# Altium schematic sheet DC_DC_ISO.SchDoc
size Legal
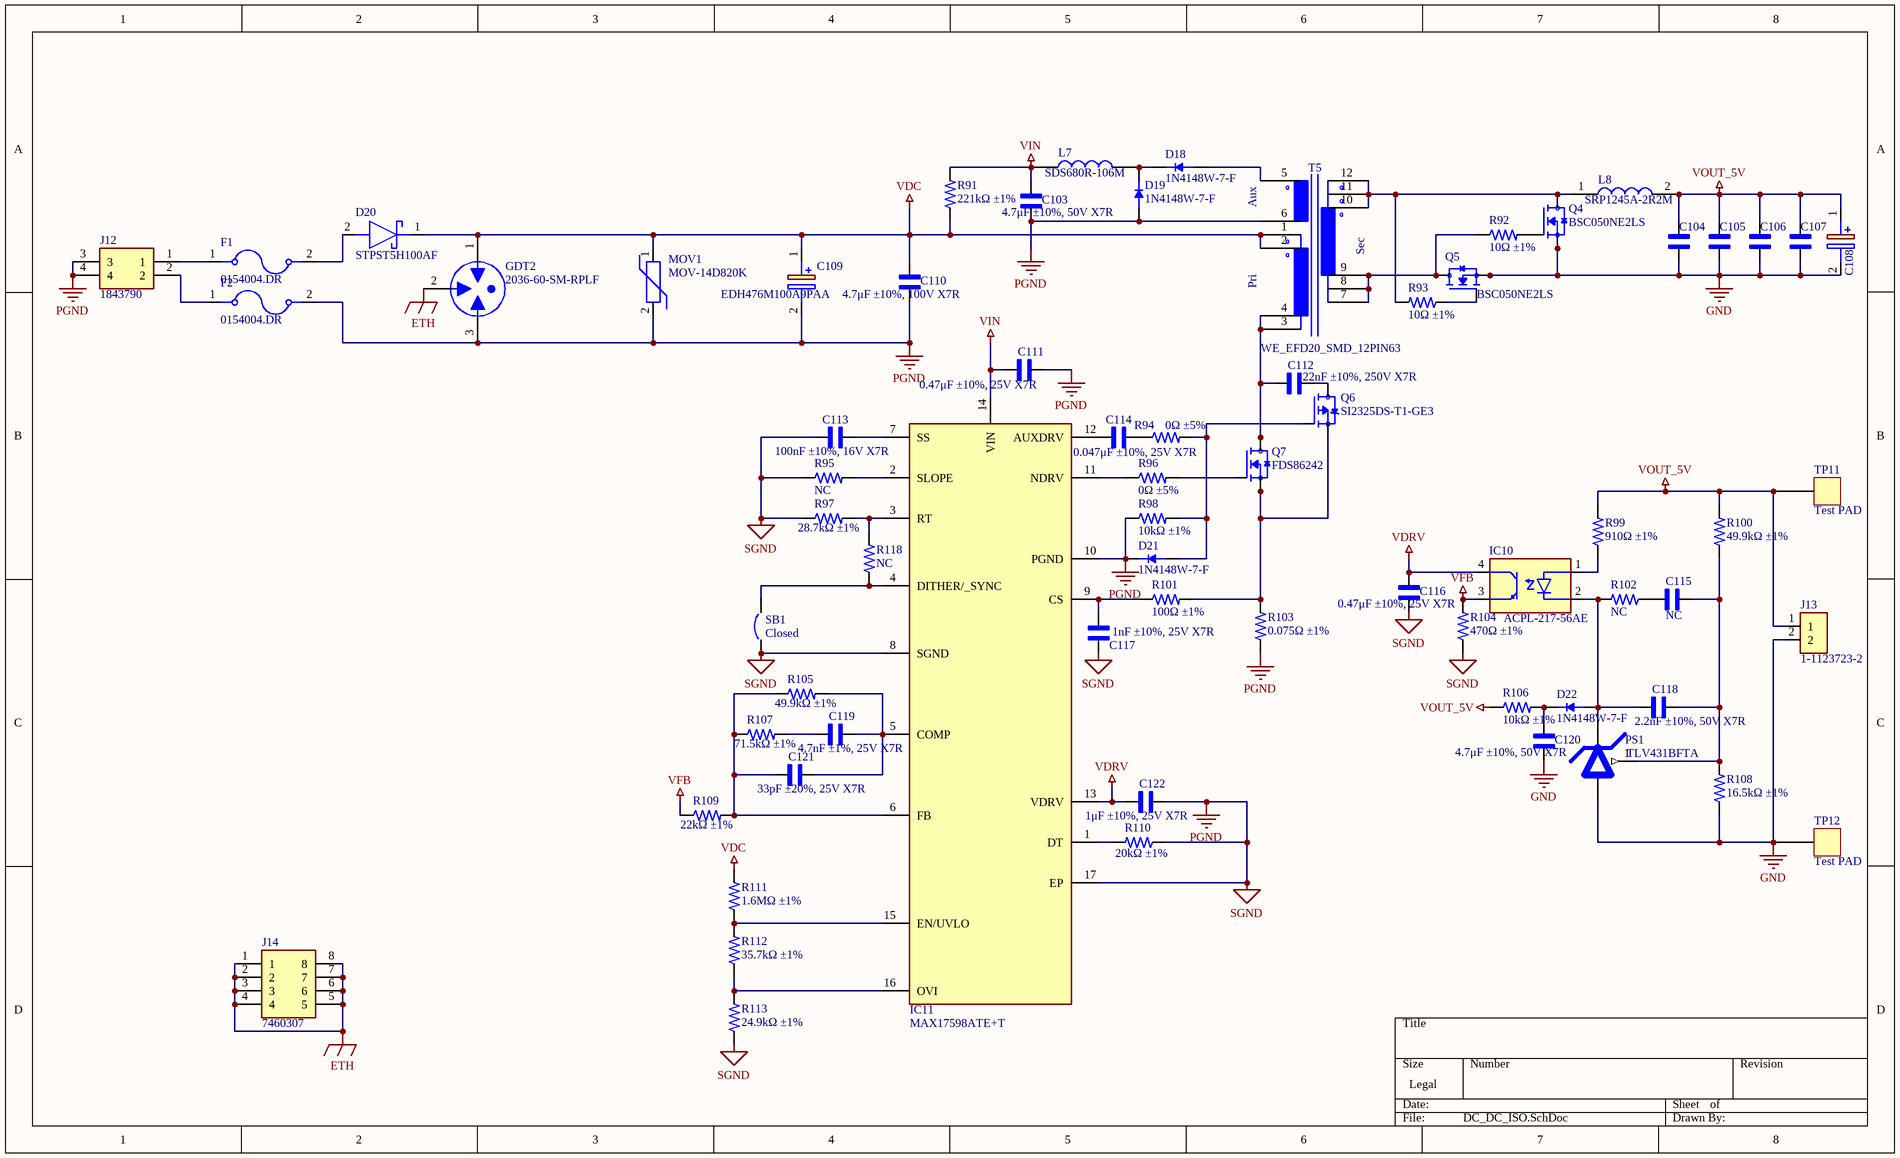
[diagram p0: DC_DC_ISO.SchDoc]

## Parts
C103  4.7μF ±10%, 50V X7R  [1206_C]
C104  47μF ±10%, 10V X7R  [1210_C]  (value not drawn)
C105  47μF ±10%, 10V X7R  [1210_C]  (value not drawn)
C106  47μF ±10%, 10V X7R  [1210_C]  (value not drawn)
C107  47μF ±10%, 10V X7R  [1210_C]  (value not drawn)
C108  TCJ5477M016R0100E/NI  [CAPPM7344X400N]  (value not drawn)
C109  EDH476M100A9PAA  [CAPAE1030X1050N]
C110  4.7μF ±10%, 100V X7R  [1210_C]
C111  0.47μF ±10%, 25V X7R  [0603_C]
C112  22nF ±10%, 250V X7R  [0805_C]
C113  100nF ±10%, 16V X7R  [0603_C]
C114  0.047μF ±10%, 25V X7R  [0603_C]
C115  NC  [0603_C]
C116  0.47μF ±10%, 25V X7R  [0603_C]
C117  1nF ±10%, 25V X7R  [0603_C]
C118  2.2nF ±10%, 50V X7R  [0603_C]
C119  4.7nF ±1%, 25V X7R  [0603_C]
C120  4.7μF ±10%, 50V X7R  [1206_C]
C121  33pF ±20%, 25V X7R  [0603_C]
C122  1μF ±10%, 25V X7R  [0805_C]
D18  1N4148W-7-F  [SOD3715X135N]
D19  1N4148W-7-F  [SOD3715X135N]
D20  STPST5H100AF  [SODFL4724X103N]
D21  1N4148W-7-F  [SOD3715X135N]
D22  1N4148W-7-F  [SOD3715X135N]
F1  0154004.DR  [FUSE_0154004.DR]
F2  0154004.DR  [FUSE_0154004.DR]
GDT2  2036-60-SM-RPLF  [2036-60-SM-RPLF]
IC10  ACPL-217-56AE  [SOIC127P700X242-4N]
IC11  MAX17598ATE+T  [QFN50P300X300X80-17N]
J12  1843790  [1843790]
J13  1-1123723-2  [TE_1-1123723-2]
J14  7460307  [7460307]
L7  SDS680R-106M  [SRR6603332ML]
L8  SRP1245A-2R2M  [INDPM135125X500N]
MOV1  MOV-14D820K  [MOV-14D820K]
PS1  TLV431BFTA  [SOT96P240X100-3N]
Q4  BSC050NE2LS  [BSC050NE2LS]
Q5  BSC050NE2LS  [BSC050NE2LS]
Q6  SI2325DS-T1-GE3  [SOT-23]
Q7  FDS86242  [SOIC127P600X175-8N]
R91  221kΩ ±1%  [0805_R]
R92  10Ω ±1%  [0603_R]
R93  10Ω ±1%  [0603_R]
R94  0Ω ±5%  [0603_R]
R95  NC  [0603_R]
R96  0Ω ±5%  [0603_R]
R97  28.7kΩ ±1%  [0603_R]
R98  10kΩ ±1%  [0603_R]
R99  910Ω ±1%  [0603_R]
R100  49.9kΩ ±1%  [0603_R]
R101  100Ω ±1%  [0603_R]
R102  NC  [0603_R]
R103  0.075Ω ±1%  [1206_R]
R104  470Ω ±1%  [0603_R]
R105  49.9kΩ ±1%  [0603_R]
R106  10kΩ ±1%  [0603_R]
R107  71.5kΩ ±1%  [0603_R]
R108  16.5kΩ ±1%  [0603_R]
R109  22kΩ ±1%  [0603_R]
R110  20kΩ ±1%  [0603_R]
R111  1.6MΩ ±1%  [0805_R]
R112  35.7kΩ ±1%  [0603_R]
R113  24.9kΩ ±1%  [0603_R]
R118  NC  [0603_R]
SB1  Closed  [SB_0603]
T5  WE_EFD20_SMD_12PIN63  [WE_EFD20_SMD_12PIN63]
TP11  Test PAD  [Test PAD]
TP12  Test PAD  [Test PAD]

## Nets
ETH: GDT2.2(E) J14.1 J14.2 J14.3 J14.4 J14.5 J14.6 J14.7 J14.8
GND: C104.2 C105.2 C106.2 C107.2 C108.2(-) C120.2 J13.2 PS1.3(ANODE) Q4.1(S) Q4.2(S) Q4.3(S) Q5.1(S) Q5.2(S) Q5.3(S) R108.1 TP12.1
PGND: C103.2 C109.2(-) C110.2 C111.2 C113.1 C116.2 C117.2 C122.2 D19.A D21.C(K) F2.2 GDT2.3(B) IC11.8(SGND) IC11.10(PGND) IC11.17(EP) J12.3 J12.4 MOV1.2 R95.1 R97.1 R98.1 R103.1 R104.1 R110.1 R113.1 SB1.1 T5.6  [also labelled SGND]
VDC: C109.1(+) C110.1 D20.1(K) GDT2.1(A) MOV1.1 R91.1 R111.2 T5.1 T5.2
VDRV: C116.1 C122.1 IC10.4(COLLECTOR) IC11.13(VDRV)
VFB: IC10.3(EMITTER) R104.2 R109.1
VIN: C103.1 C111.1 IC11.14(VIN) L7.1 R91.2
VOUT_5V: C104.1 C105.1 C106.1 C107.1 C108.1(+) J13.1 L8.2 R99.2 R100.2 R106.1 TP11.1
NetC112_1: C112.1 Q6.3(D)
NetC112_2: C112.2 Q7.5(D) Q7.6(D) Q7.7(D) Q7.8(D) T5.3 T5.4
NetC113_2: C113.2 IC11.7(SS)
NetC114_1: C114.1 R94.1
NetC114_2: C114.2 IC11.12(AUXDRV)
NetC115_1: C115.1 C118.1 PS1.1(REF) R100.1 R108.2
NetC115_2: C115.2 R102.1
NetC117_1: C117.1 IC11.9(CS) R101.1
NetC118_2: C118.2 D22.A IC10.2(CATHODE) PS1.2(CATHODE) R102.2
NetC119_1: C119.1 R107.2
NetC119_2: C119.2 C121.2 IC11.5(COMP) R105.2
NetC120_1: C120.1 D22.C(K) R106.2
NetC121_1: C121.1 IC11.6(FB) R105.1 R107.1 R109.2
NetD18_A: D18.A T5.5
NetD18_C: D18.C(K) D19.C(K) L7.2
NetD20_2: D20.2(A) F1.2
NetD21_A: D21.A Q6.1(G) R94.2 R98.2
NetF1_1: F1.1 J12.1
NetF2_1: F2.1 J12.2
NetIC10_1: IC10.1(ANODE) R99.1
NetIC11_1: IC11.1(DT) R110.2
NetIC11_2: IC11.2(SLOPE) R95.2
NetIC11_3: IC11.3(RT) R97.2 R118.2
NetIC11_4: IC11.4(DITHER/_SYNC) R118.1 SB1.2
NetIC11_11: IC11.11(NDRV) R96.1
NetIC11_15: IC11.15(EN/UVLO) R111.1 R112.2
NetIC11_16: IC11.16(OVI) R112.1 R113.2
NetL8_1: L8.1 Q4.5(D) Q4.6(D) Q4.7(D) Q4.8(D) Q4.9(D) R93.2 T5.10 T5.11 T5.12
NetQ4_4: Q4.4(G) R92.2
NetQ5_4: Q5.4(G) R93.1
NetQ5_5: Q5.5(D) Q5.6(D) Q5.7(D) Q5.8(D) Q5.9(D) R92.1 T5.7 T5.8 T5.9
NetQ6_2: Q6.2(S) Q7.1(S) Q7.2(S) Q7.3(S) R101.2 R103.2
NetQ7_4: Q7.4(G) R96.2

## Notes on the sheet
- (in symbol WE_EFD20_SMD_12PIN63) Aux; Sec; Pri

## Library data of the parts
C103 C110-C122 = CAP: MP: LD03ZD475MAB2A; Package: None; Price: None; Value: *; Availability: Unavailable
C104-C107 = CAP: Capacitor non polar; MP: LD03ZD475MAB2A; Package: None; Price: None; Value: *; Availability: Unavailable
C108 = TCJ5477M016R0100E: Capacitor Polarised; Manufacturer_Name: AVX; Datasheet Link: https://datasheets.kyocera-avx.com/TCJ.pdf; Height: 4mm; Manufacturer_Part_Number: TCJ5477M016R0100E; Mouser Part Number: 581-TCJ5477M016R100E; Mouser Price/Stock: https://www.mouser.co.uk/ProductDetail/AVX/TCJ5477M016R0100E?qs=hWgE7mdIu5QV3CO1kSXQRw%3D%3D
C109 = EDH476M100A9PAA: Capacitor Polarised; Manufacturer_Name: KEMET; Datasheet Link: https://content.kemet.com/datasheets/KEM_A4049_EDH.pdf; Height: 10.5mm; Manufacturer_Part_Number: EDH476M100A9PAA; Mouser Part Number: 80-EDH476M100A9PAA; Mouser Price/Stock: https://www.mouser.co.uk/ProductDetail/KEMET/EDH476M100A9PAA?qs=E9QF1UCAUX7o%252BSuv4vgBDA%3D%3D; Arrow Part Number: EDH476M100A9PAA; Arrow Price/Stock: https://www.arrow.com/en/products/edh476m100a9paa/kemet-corporation?region=nac
D18 D19 D21 D22 = 1N4148W-7-F: Diode Standard 100 V 300mA (DC) Surface Mount SOD-123; MF: Diodes Inc.; Value: *; Availability: In Stock; Package: SOD-123 Fairchild Semiconductor; SnapEDA_Link: https://www.snapeda.com/parts/1N4148W-7-F/Diodes+Inc./view-part/?ref=snap; Price: None; Check_prices: https://www.snapeda.com/parts/1N4148W-7-F/Diodes+Inc./view-part/?ref=eda; Purchase-URL: https://pricing.snapeda.com/search/part/1N4148W-7-F/?ref=eda; MP: 1N4148W-7-F
D20 = STPST5H100AF: Schottky Diode; Manufacturer_Name: STMicroelectronics; Datasheet Link: https://www.st.com/resource/en/datasheet/stpst5h100.pdf; Height: 1.03mm; Manufacturer_Part_Number: STPST5H100AF; Mouser Part Number: 511-STPST5H100AF; Mouser Price/Stock: https://www.mouser.co.uk/ProductDetail/STMicroelectronics/STPST5H100AF?qs=Jm2GQyTW%2Fbg40alT%252BULHUw%3D%3D
F1 F2 = 0154004.DR: 154/154T/154L/154TL Series OMNI-BLOKÂ® Fuse and Holder Assembly; Package: None; Availability: Unavailable; Value: *; MP: 0154004.DR; Price: None
GDT2 = 2036-60-SM-RPLF: Gas Discharge Tubes - GDTs / Gas Plasma Arrestors Sparkover100V/s 600V Miniature 3 Pole
IC10 = ACPL-217-56AE: Integrated Circuit; Manufacturer_Name: Avago Technologies; Datasheet Link: https://docs.broadcom.com/docs/AV02-0470EN; Height: 2.42mm; Manufacturer_Part_Number: ACPL-217-56AE; Mouser Part Number: 630-ACPL-217-56AE; Mouser Price/Stock: https://www.mouser.co.uk/ProductDetail/Broadcom-Avago/ACPL-217-56AE?qs=dcm2zoLQumBcA1gigmq0vA%3D%3D
IC11 = MAX17598ATE+T: Integrated Circuit; Manufacturer_Name: Analog Devices; Datasheet Link: https://www.mouser.in/datasheet/2/256/MAX17599-1513910.pdf; Height: 0.8mm; Manufacturer_Part_Number: MAX17598ATE+T; Mouser Part Number: 700-MAX17598ATE+T; Mouser Price/Stock: https://www.mouser.co.uk/ProductDetail/Maxim-Integrated/MAX17598ATE%2bT?qs=0JU57JYmZjvlV4vexIaXHA%3D%3D; Arrow Part Number: MAX17598ATE+T; Arrow Price/Stock: https://www.arrow.com/en/products/max17598atet/maxim-integrated?region=nac
J12 = 1843790: Connector; Manufacturer_Name: Phoenix Contact; Datasheet Link: http://www.phoenixcontact.com/de/produkte/1843790/pdf; Height: 7.4mm; Manufacturer_Part_Number: 1843790; Mouser Part Number: 651-1843790; Mouser Price/Stock: https://www.mouser.co.uk/ProductDetail/Phoenix-Contact/1843790?qs=8BCRtFWWXOSOfz2GfgipZg%3D%3D; Arrow Part Number: 1843790; Arrow Price/Stock: https://www.arrow.com/en/products/1843790/phoenix-contact?region=nac
J13 = 1-1123723-2: 3.96 EP HDR ASSY 2P_NATURAL_; Number_of_Positions: 2; MF: TE Connectivity; Product_Type: Header; Centerline_Pitch: 3.96 mm[.156 in]; EU_RoHS_Compliance: Compliant; Value: *; TE_purchase_URL: https://www.te.com/usa-en/product-1-1123723-2.html?te_bu=Cor&te_type=disp&te_campaign=seda_glo_cor-seda-global-disp-prtnr-fy19-seda-model-bom-cta_sma-317_1&elqCampaignId=32493; SnapEDA_Link: https://www.snapeda.com/parts/1-1123723-2/TE%20Connectivity%20AMP%20Connectors/view-part/231687/?ref=snap; Package: None; MP: 1-1123723-2; Digi-Key_Purchase_URL: https://www.digikey.com/product-detail/en/te-connectivity-amp-connectors/1-1123723-2/A111830-ND/686925?utm_source=snapeda&utm_medium=aggregator&utm_campaign=symbol; Digi-Key_Part_Number: A111830-ND
J14 = 7460307: Connector; Manufacturer_Name: Wurth Elektronik; Datasheet Link: https://katalog.we-online.com/em/datasheet/7460307.pdf; Height: 7mm; Manufacturer_Part_Number: 7460307; Mouser Part Number: 710-7460307; Mouser Price/Stock: https://www.mouser.co.uk/ProductDetail/Wurth-Elektronik/7460307?qs=lykWx4dhCCG1TLZtVq%252B8cQ%3D%3D
L7 = SDS680R-106M: Inductor 10mH; Manufacturer_Name: Bourns; Manufacturer_Part_Number: SRR6603-103ML; Datasheet Link: https://www.bourns.com/docs/Product-Datasheets/SRR6603.pdf; Height: 3mm; Mouser Part Number: 652-SRR6603-103ML; Mouser Price/Stock: https://www.mouser.co.uk/ProductDetail/Bourns/SRR6603-103ML?qs=Nb99Pa9xYq%252Bz9Mktch6%252BTg%3D%3D; Arrow Part Number: SRR6603-103ML; Arrow Price/Stock: https://www.arrow.com/en/products/srr6603-103ml/bourns
L8 = SRP1245A-2R2M: Inductor 2.2uH; Manufacturer_Name: Bourns; Datasheet Link: https://www.bourns.com/docs/Product-Datasheets/SRP1245A.pdf; Height: 5mm; Manufacturer_Part_Number: SRP1245A-2R2M; Mouser Part Number: 652-SRP1245A-2R2M; Mouser Price/Stock: https://www.mouser.co.uk/ProductDetail/Bourns/SRP1245A-2R2M?qs=7z%252BmIopC6%2FIfpuWA3q0S0Q%3D%3D; Arrow Part Number: SRP1245A-2R2M; Arrow Price/Stock: https://www.arrow.com/en/products/srp1245a-2r2m/bourns?region=nac
MOV1 = MOV-14D820K: Varistors 82volts 14mm; MP: MOV-14D471K; MF: Bourns; Price: None; SnapEDA_Link: https://www.snapeda.com/parts/MOV-14D471K/Bourns/view-part/?ref=snap; Package: Disc-14 Bourns; Availability: In Stock; Check_prices: https://www.snapeda.com/parts/MOV-14D471K/Bourns/view-part/?ref=eda; Purchase-URL: https://pricing.snapeda.com/search/part/MOV-14D471K/?ref=eda; Value: *
PS1 = TLV431BFTA: Power Supply; Manufacturer_Name: Diodes Inc.; Datasheet Link: https://www.diodes.com/assets/Datasheets/TLV431.pdf; Height: 1mm; Manufacturer_Part_Number: TLV431BFTA; Mouser Part Number: 621-TLV431BFTA; Mouser Price/Stock: https://www.mouser.co.uk/ProductDetail/Diodes-Incorporated/TLV431BFTA?qs=nSryOFbzj8KLzVR2LsCcOA%3D%3D; Arrow Part Number: TLV431BFTA; Arrow Price/Stock: https://www.arrow.com/en/products/tlv431bfta/diodes-incorporated?region=europe
Q4 Q5 = BSC050NE2LS: MOSFET (N-Channel); Manufacturer_Name: Infineon; Datasheet Link: https://www.infineon.com/dgdl/Infineon-BSC050NE2LS-DataSheet-v02_04-EN.pdf?fileId=db3a304326dfb1300126fb5ce0cb3f2d; Height: 1.2mm; Manufacturer_Part_Number: BSC050NE2LS; Mouser Part Number: 726-BSC050NE2LS; Mouser Price/Stock: https://www.mouser.co.uk/ProductDetail/Infineon-Technologies/BSC050NE2LS?qs=HwMeRNENlMaXFFR8DpmvKQ%3D%3D
Q6 = SI2325DS-T1-GE3: 150V 0.69A 1.25W 1.2ohm at 10V; MF: Vishay Siliconix; SnapEDA_Link: https://www.snapeda.com/parts/SI2325DS-T1-GE3/Vishay+Siliconix/view-part/?ref=snap; Package: SOT-23-3 Vishay Siliconix; Value: *; MP: SI2325DS-T1-GE3; Check_prices: https://www.snapeda.com/parts/SI2325DS-T1-GE3/Vishay+Siliconix/view-part/?ref=eda
Q7 = FDS86242: Integrated Circuit; Manufacturer_Name: onsemi; Datasheet Link: https://datasheet.datasheetarchive.com/originals/distributors/Datasheets_SAMA/beddb12da8e05a49ab7133607c08bb07.pdf; Height: 1.75mm; Manufacturer_Part_Number: FDS86242; Mouser Part Number: 512-FDS86242; Mouser Price/Stock: https://www.mouser.co.uk/ProductDetail/ON-Semiconductor-Fairchild/FDS86242?qs=WZYOKEqGBpJo60pi1Jf2hA%3D%3D; Arrow Part Number: FDS86242; Arrow Price/Stock: https://www.arrow.com/en/products/fds86242/on-semiconductor
R91-R113 R118 = RES: MP: 3-1879460-6; Package: None; Price: None; Value: *; Availability: Unavailable
SB1 = Circuit Breaker_close: Circuit Breaker; Published: 24-Mar-1999; Revision: July-2002: Re-released for DXP Platform.; Publisher: Altium Limited
T5 = WE_EFD20_SMD_12PIN63: Transformer; Manufacturer_Name: Wurth Elektronik; Manufacturer_Part_Number: 7491194912; Mouser Part Number: 710-7491194912; Mouser Price/Stock: https://www.mouser.co.uk/ProductDetail/Wurth-Elektronik/7491194912?qs=PGXP4M47uW77qoYmvw4NKA%3D%3D